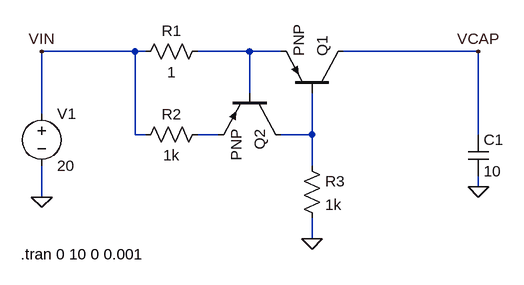
[diagram p0: schematic Draft10.asc]
Draft10.asc, the LTspice schematic file:
Version 4.1
SHEET 1 880 680
WIRE 0 -96 -144 -96
WIRE 16 -96 0 -96
WIRE 176 -96 96 -96
WIRE 224 -96 176 -96
WIRE 528 -96 320 -96
WIRE 176 -32 176 -96
WIRE -144 0 -144 -96
WIRE 0 32 0 -96
WIRE 16 32 0 32
WIRE 128 32 96 32
WIRE 272 32 272 -32
WIRE 272 32 224 32
WIRE 528 32 528 -96
WIRE 272 80 272 32
WIRE 528 112 528 96
WIRE -144 128 -144 80
WIRE 272 192 272 160
FLAG 272 192 0
FLAG -144 128 0
FLAG 528 112 0
FLAG 528 -96 VCAP
FLAG -144 -96 VIN
SYMBOL pnp 320 -32 M270
SYMATTR InstName Q1
SYMBOL pnp 224 -32 R90
SYMATTR InstName Q2
SYMBOL res 112 -112 R90
WINDOW 0 0 56 VBottom 2
WINDOW 3 32 56 VTop 2
SYMATTR InstName R1
SYMATTR Value 1
SYMBOL res 112 16 R90
WINDOW 0 0 56 VBottom 2
WINDOW 3 32 56 VTop 2
SYMATTR InstName R2
SYMATTR Value 1k
SYMBOL res 256 64 R0
SYMATTR InstName R3
SYMATTR Value 1k
SYMBOL voltage -144 -16 R0
WINDOW 123 0 0 Left 0
WINDOW 39 0 0 Left 0
SYMATTR InstName V1
SYMATTR Value 20
SYMBOL cap 512 32 R0
SYMATTR InstName C1
SYMATTR Value 10
SYMATTR SpiceLine V=27 Rser=0.2
TEXT -176 216 Left 2 !.tran 0 10 0 0.001

The netlist it stands for:
* Draft10.asc
Q1 VCAP N003 N001 0 PNP
Q2 N003 N001 N002 0 PNP
R1 N001 VIN 1
R2 N002 VIN 1k
R3 N003 0 1k
V1 VIN 0 20
C1 VCAP 0 10 V=27 Rser=0.2
.model NPN NPN
.model PNP PNP
.lib standard.bjt
.tran 0 10 0 0.001
.backanno
.end